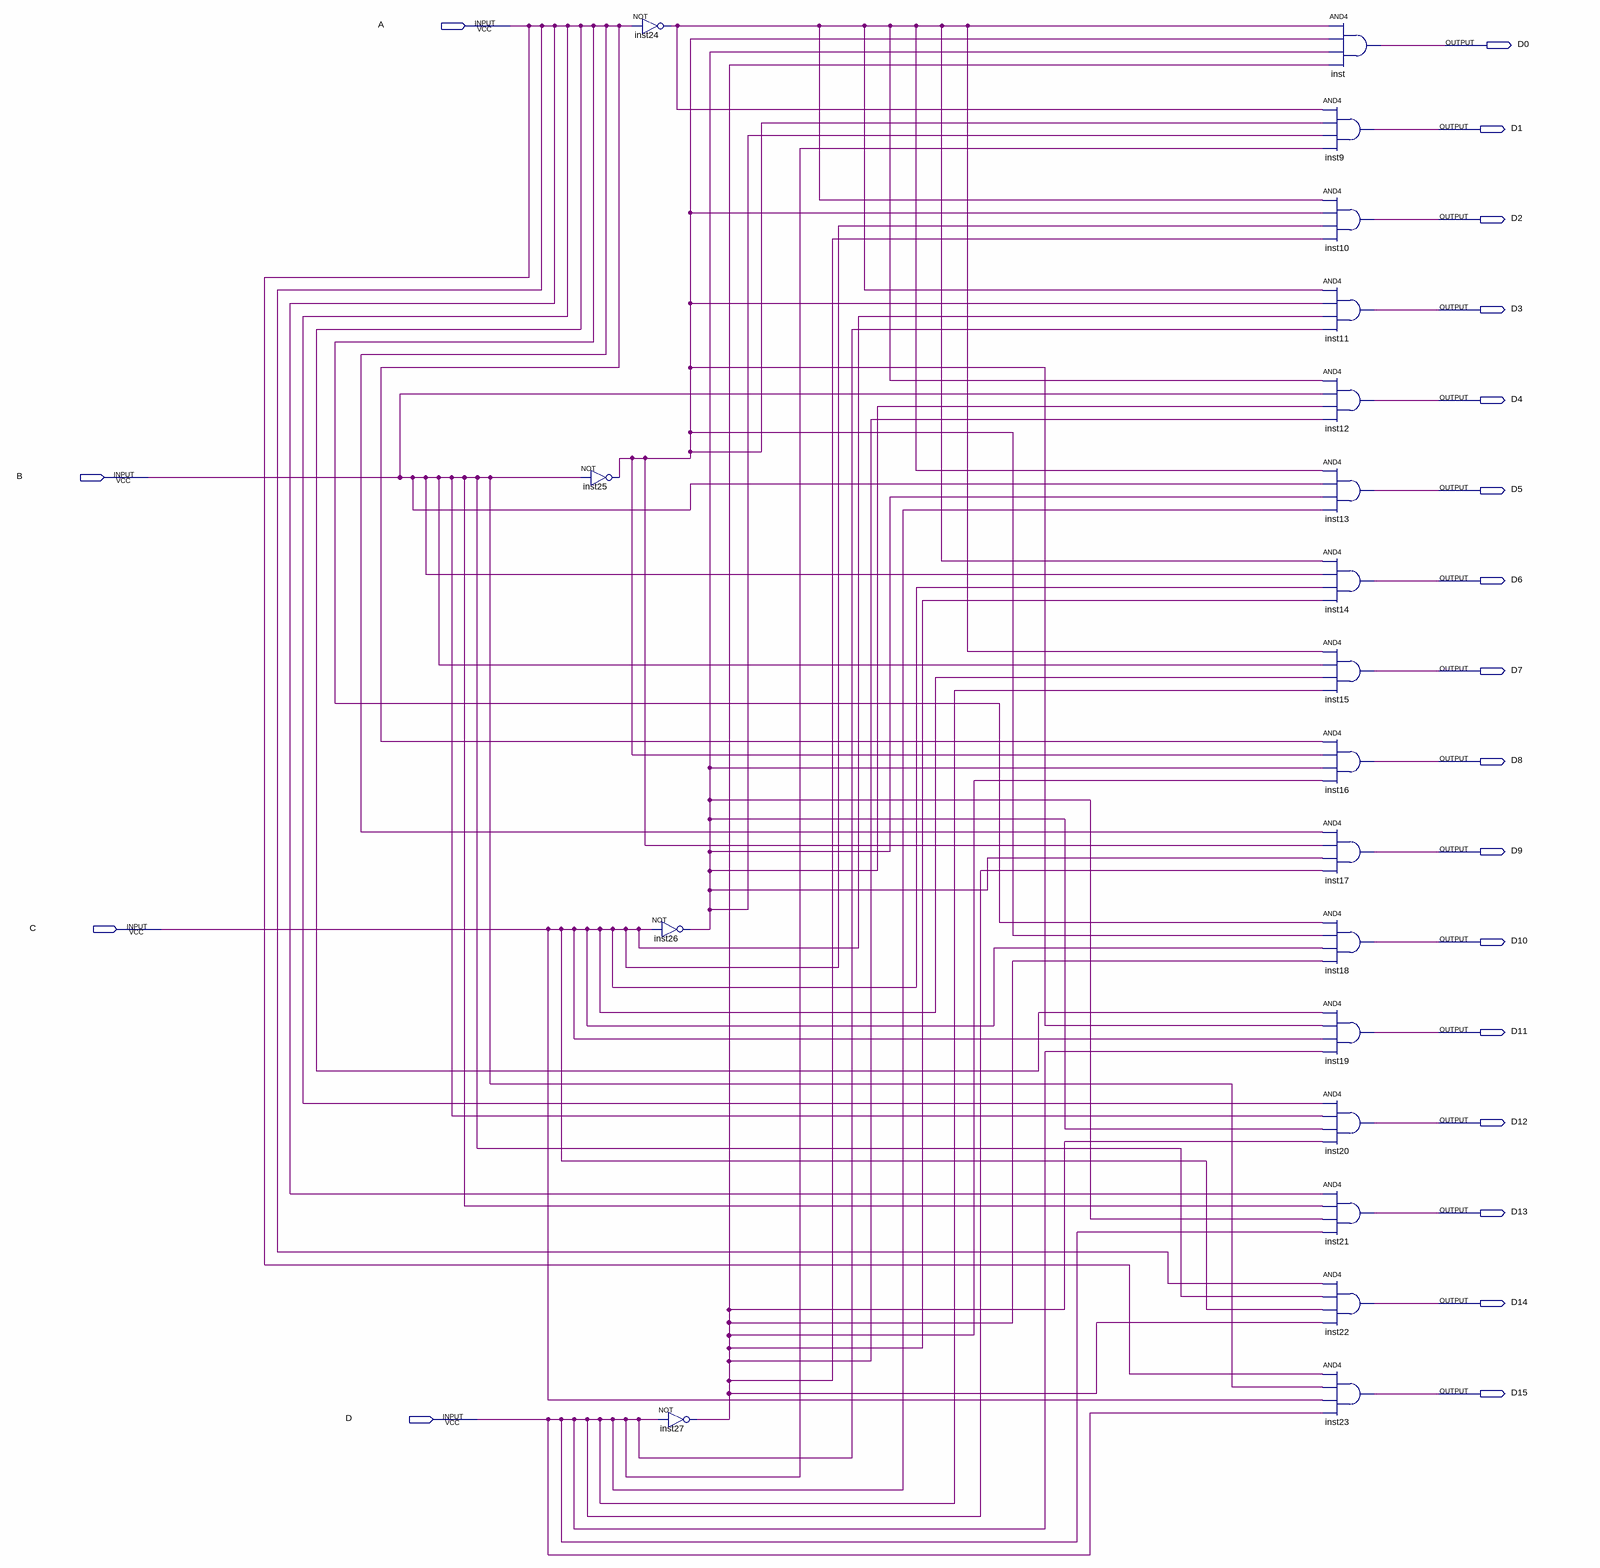
[diagram p0: schematic sheet]
// Quartus schematic DECOCUATROADIECISEIS.bdf as structural Verilog: 20 symbols, 20 pins
module DECOCUATROADIECISEIS (
  input  A,
  input  B,
  input  C,
  input  D,
  output D0,
  output D1,
  output D2,
  output D3,
  output D4,
  output D5,
  output D6,
  output D7,
  output D8,
  output D9,
  output D10,
  output D11,
  output D12,
  output D13,
  output D14,
  output D15
);

  wire inst24_out, inst25_out, inst26_out, inst27_out;

  not inst25 (inst25_out, B);
  not inst24 (inst24_out, A);
  not inst26 (inst26_out, C);
  not inst27 (inst27_out, D);
  and inst9 (D1, inst24_out, inst25_out, inst26_out, D);
  and inst10 (D2, inst24_out, inst25_out, C, inst27_out);
  and inst11 (D3, inst24_out, inst25_out, C, D);
  and inst12 (D4, inst24_out, B, inst26_out, inst27_out);
  and inst13 (D5, inst24_out, B, inst26_out, D);
  and inst14 (D6, inst24_out, B, C, inst27_out);
  and inst15 (D7, inst24_out, B, C, D);
  and inst16 (D8, A, inst25_out, inst26_out, inst27_out);
  and inst17 (D9, A, inst25_out, inst26_out, D);
  and inst18 (D10, A, inst25_out, C, inst27_out);
  and inst19 (D11, A, inst25_out, C, D);
  and inst20 (D12, A, B, inst26_out, inst27_out);
  and inst21 (D13, A, B, inst26_out, D);
  and inst22 (D14, A, B, C, inst27_out);
  and inst23 (D15, A, B, C, D);
  and inst (D0, inst24_out, inst25_out, inst26_out, inst27_out);
endmodule
